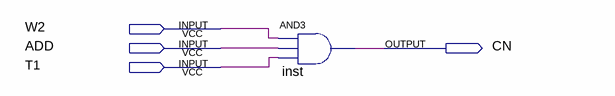
[diagram p0: schematic sheet]
// Quartus schematic CN.bdf as structural Verilog: 1 symbols, 4 pins
module CN (
  input  W2,
  input  ADD,
  input  T1,
  output CN
);

  and inst (CN, W2, ADD, T1);
endmodule
